# Altium schematic sheet Raspberry Pi Interface.SchDoc
size A3
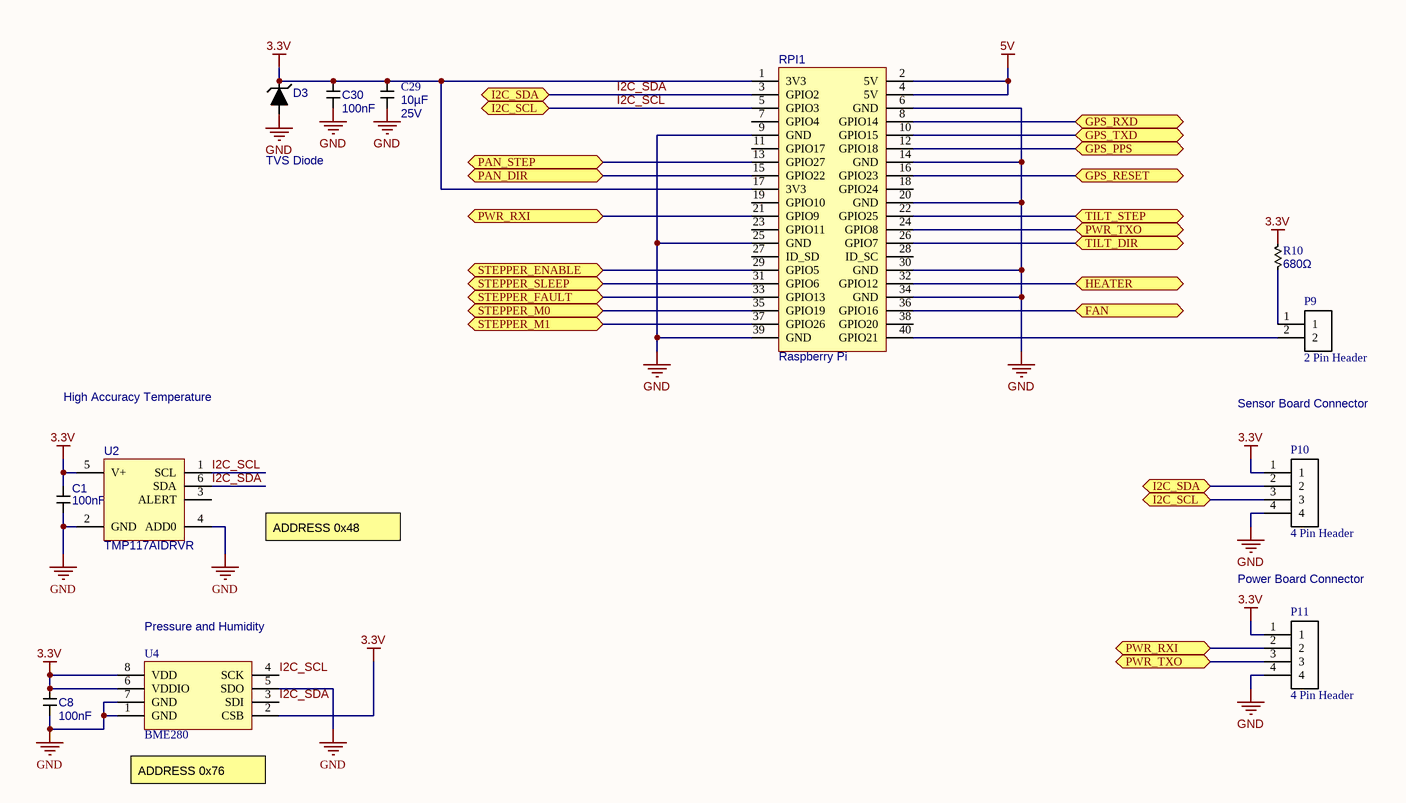
[diagram p0: Raspberry Pi Interface.SchDoc]

## Parts
?  (no value)
C1  100nF  [C0805]
C8  100nF  [C0805]
C29  Voltage Rating: 25V  Capacitance: 10µF  [C0805]  (hidden comment: F)
C30  100nF  [C0805]
D3  TVS Diode  [SP4020-01FTG-C]
P9  2 Pin Header  [S2B-XH-A(LF)(SN)]
P10  4 Pin Header  [B4B-XH-A]
P11  4 Pin Header  [B4B-XH-A]
R10  680Ω  [R0805]
RPI1  Raspberry Pi  [Raspberry Pi 4B]
U2  TMP117AIDRVR  [TMP117AIDRVR]
U4  BME280  [BME280]

## Ports
FAN, GPS_PPS, GPS_RESET, GPS_RXD, GPS_TXD, HEATER, I2C_SCL, I2C_SDA, PAN_DIR, PAN_STEP, PWR_RXI, PWR_TXO, STEPPER_ENABLE, STEPPER_FAULT, STEPPER_M0, STEPPER_M1, STEPPER_SLEEP, TILT_DIR, TILT_STEP

## Nets
3.3V: C1.1 C8.1 C29.1 C30.1 D3.1 P10.1 P11.1 R10.2 RPI1.1(3V3) RPI1.17(3V3) U2.5(V+) U4.2(CSB) U4.6(VDDIO) U4.8(VDD)
5V: RPI1.2(5V) RPI1.4(5V)
GND: C1.2 C8.2 C29.2 C30.2 D3.2 P10.4 P11.4 RPI1.6(GND) RPI1.9(GND) RPI1.14(GND) RPI1.20(GND) RPI1.25(GND) RPI1.30(GND) RPI1.34(GND) RPI1.39(GND) U2.2(GND) U2.4(ADD0) U4.1(GND) U4.5(SDO) U4.7(GND)
FAN: RPI1.36(GPIO16) ; port FAN
GPS_PPS: RPI1.12(GPIO18) ; port GPS_PPS
GPS_RESET: RPI1.16(GPIO23) ; port GPS_RESET
GPS_RXD: RPI1.8(GPIO14) ; port GPS_RXD
GPS_TXD: RPI1.10(GPIO15) ; port GPS_TXD
HEATER: RPI1.32(GPIO12) ; port HEATER
I2C_SCL: P10.3 RPI1.5(GPIO3) U2.1(SCL) U4.4(SCK) ; port I2C_SCL
I2C_SDA: P10.2 RPI1.3(GPIO2) U2.6(SDA) U4.3(SDI) ; port I2C_SDA
PAN_DIR: RPI1.15(GPIO22) ; port PAN_DIR
PAN_STEP: RPI1.13(GPIO27) ; port PAN_STEP
PWR_RXI: P11.2 RPI1.21(GPIO9) ; port PWR_RXI
PWR_TXO: P11.3 RPI1.24(GPIO8) ; port PWR_TXO
STEPPER_ENABLE: RPI1.29(GPIO5) ; port STEPPER_ENABLE
STEPPER_FAULT: RPI1.33(GPIO13) ; port STEPPER_FAULT
STEPPER_M0: RPI1.35(GPIO19) ; port STEPPER_M0
STEPPER_M1: RPI1.37(GPIO26) ; port STEPPER_M1
STEPPER_SLEEP: RPI1.31(GPIO6) ; port STEPPER_SLEEP
TILT_DIR: RPI1.26(GPIO7) ; port TILT_DIR
TILT_STEP: RPI1.22(GPIO25) ; port TILT_STEP
NetP9_1: P9.1 R10.1
NetP9_2: P9.2 RPI1.40(GPIO21)

Not connected (* = marked no-connect by the designer): RPI1 7(GPIO4) 11(GPIO17) 18(GPIO24) 19(GPIO10) 23(GPIO11) 27(ID_SD) 28(ID_SC) 38(GPIO20); U2 3(ALERT)

## Notes on the sheet
- High Accuracy Temperature
- Sensor Board Connector
- ADDRESS 0x48
- Power Board Connector
- (near U4) Pressure and Humidity
- (near U4) ADDRESS 0x76
- DRAWN BY
- CHECKED BY
- DATE
- TITLE
- Title
- Size:
- Date:
- A3
- Number:
- Time:
- Revision:
- Sheet
- of
- APPROVED BY
- RELEASED BY
- SCALE:
- SIZE
- DRAWING NUMBER
- SHEET
- -
- OF
- File:

## Library data of the parts
? = Title Block
C1 C8 C30 = Capacitor: Manufacturer: YAGEO; Manufacturer Part Number: CC0805KRX7R9BB104; Tolerance: ±10%; Temperature Coefficient: X7R; Voltage Rating: 50V; Supplier: Digi-Key Electronics; Supplier Part Number: 311-1140-1-ND; Capacitance: 100nF
C29 = Capacitor: Manufacturer: Samsung Electro-Mechanics; Manufacturer Part Number: CL21A106KAYNNNG; Supplier: Digi-Key Electronics; Supplier Part Number: 1276-6454-1-ND; Price: 0.28
D3 = Diode TVS: Manufacturer: Littelfuse Inc.; Supplier: Digi-Key Electronics; Supplier Part Number: F6271CT-ND; Manufacturer Part Number: SP4020-01FTG-C
P9 = Header 2: Manufacturer: JST Sales America Inc.; Manufacturer Part Number: S2B-XH-A; Supplier: Digi-Key Electronics; Supplier Part Number: 455-S2B-XH-A-ND
P10 P11 = Header 4: Manufacturer: JST; Manufacturer Part Number: B4B-XH-2; Supplier: Digi-Key Electronics; Supplier Part Number: 455-B4B-XH-A-ND
R10 = Resistor: Standard Resistor; Manufacturer: Panasonic Electronic Components; Manufacturer Part Number: ERJ-6GEYJ681V; Power Rating: 1/8W; Supplier: Digi-Key Electronics; Supplier Part Number: P680ACT-ND; Price: 0.16; Resistance: 680Ω
RPI1 = Raspberry Pi 40 Pin Header: Manufacturer Part Number: PPTC202LFBN-RC; Manufacturer: Sullins Connector Solutions; Current Rating: 3A; Supplier: Digi-Key Electronics; Supplier Part Number: S6104-ND; Price: $2.60; Operating Temperature: -40°C ~ 105°C
U2 = TMP117AIDRVR: Temperature Sensor Digital, Local -55°C ~ 150°C 16 b 6-WSON (2x2); Manufacturer: Texas Instruments; Manufacturer Part Number: TMP117AIDRVR; Supplier: Digi-Key Electronics; Supplier Part Number: 296-51834-1-ND
U4 = BME280: Pressure and Humidity Sensor; Manufacturer: Bosch Sensortec; Supplier: Digi-Key Electronics; Supplier Part Number: 828-1063-1-ND; Manufacturer Part Number: BME280